# Altium schematic sheet Rx_TSOP.SchDoc: Balise IR-Rx - TSOP
size A3; Author: B Labbe; CompanyName: Oufffteam; DrawnBy: B Labbe; Engineer: B Labbe; Organization: Oufffteam; Address1: L3, 12a Rodborough Rd; Address2: Frenchs Forest; Address3: NSW; Address4: Australia 2086; Revision: B; SheetNumber: 5; SheetTotal: 5; DocumentName: Balise IR-Rx - TSOP
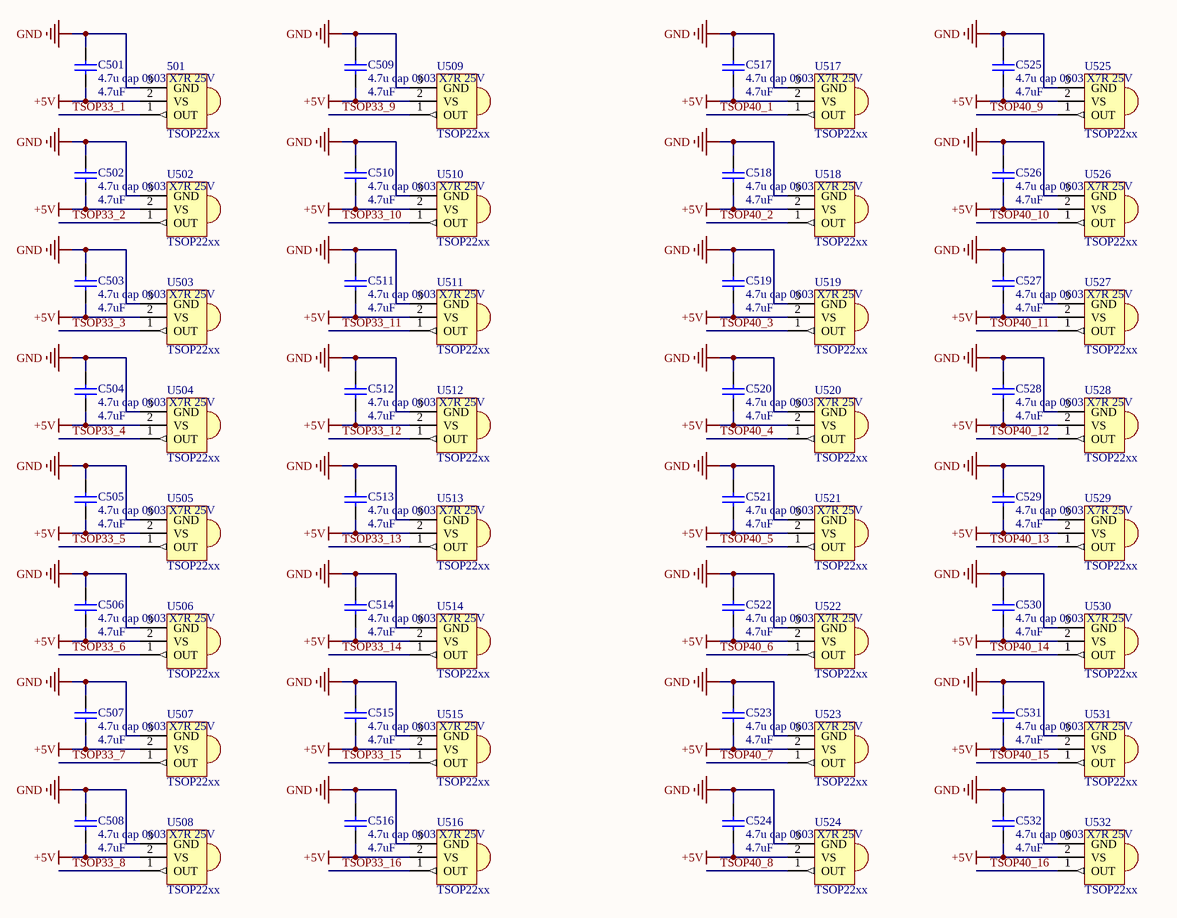
[diagram p0: Rx_TSOP.SchDoc]

## Parts
501  TSOP22xx  [TSOP22xx]
C501  4.7u cap 0603 X7R 25V  value 4.7uF  [0603]
C502  4.7u cap 0603 X7R 25V  value 4.7uF  [0603]
C503  4.7u cap 0603 X7R 25V  value 4.7uF  [0603]
C504  4.7u cap 0603 X7R 25V  value 4.7uF  [0603]
C505  4.7u cap 0603 X7R 25V  value 4.7uF  [0603]
C506  4.7u cap 0603 X7R 25V  value 4.7uF  [0603]
C507  4.7u cap 0603 X7R 25V  value 4.7uF  [0603]
C508  4.7u cap 0603 X7R 25V  value 4.7uF  [0603]
C509  4.7u cap 0603 X7R 25V  value 4.7uF  [0603]
C510  4.7u cap 0603 X7R 25V  value 4.7uF  [0603]
C511  4.7u cap 0603 X7R 25V  value 4.7uF  [0603]
C512  4.7u cap 0603 X7R 25V  value 4.7uF  [0603]
C513  4.7u cap 0603 X7R 25V  value 4.7uF  [0603]
C514  4.7u cap 0603 X7R 25V  value 4.7uF  [0603]
C515  4.7u cap 0603 X7R 25V  value 4.7uF  [0603]
C516  4.7u cap 0603 X7R 25V  value 4.7uF  [0603]
C517  4.7u cap 0603 X7R 25V  value 4.7uF  [0603]
C518  4.7u cap 0603 X7R 25V  value 4.7uF  [0603]
C519  4.7u cap 0603 X7R 25V  value 4.7uF  [0603]
C520  4.7u cap 0603 X7R 25V  value 4.7uF  [0603]
C521  4.7u cap 0603 X7R 25V  value 4.7uF  [0603]
C522  4.7u cap 0603 X7R 25V  value 4.7uF  [0603]
C523  4.7u cap 0603 X7R 25V  value 4.7uF  [0603]
C524  4.7u cap 0603 X7R 25V  value 4.7uF  [0603]
C525  4.7u cap 0603 X7R 25V  value 4.7uF  [0603]
C526  4.7u cap 0603 X7R 25V  value 4.7uF  [0603]
C527  4.7u cap 0603 X7R 25V  value 4.7uF  [0603]
C528  4.7u cap 0603 X7R 25V  value 4.7uF  [0603]
C529  4.7u cap 0603 X7R 25V  value 4.7uF  [0603]
C530  4.7u cap 0603 X7R 25V  value 4.7uF  [0603]
C531  4.7u cap 0603 X7R 25V  value 4.7uF  [0603]
C532  4.7u cap 0603 X7R 25V  value 4.7uF  [0603]
U502  TSOP22xx  [TSOP22xx]
U503  TSOP22xx  [TSOP22xx]
U504  TSOP22xx  [TSOP22xx]
U505  TSOP22xx  [TSOP22xx]
U506  TSOP22xx  [TSOP22xx]
U507  TSOP22xx  [TSOP22xx]
U508  TSOP22xx  [TSOP22xx]
U509  TSOP22xx  [TSOP22xx]
U510  TSOP22xx  [TSOP22xx]
U511  TSOP22xx  [TSOP22xx]
U512  TSOP22xx  [TSOP22xx]
U513  TSOP22xx  [TSOP22xx]
U514  TSOP22xx  [TSOP22xx]
U515  TSOP22xx  [TSOP22xx]
U516  TSOP22xx  [TSOP22xx]
U517  TSOP22xx  [TSOP22xx]
U518  TSOP22xx  [TSOP22xx]
U519  TSOP22xx  [TSOP22xx]
U520  TSOP22xx  [TSOP22xx]
U521  TSOP22xx  [TSOP22xx]
U522  TSOP22xx  [TSOP22xx]
U523  TSOP22xx  [TSOP22xx]
U524  TSOP22xx  [TSOP22xx]
U525  TSOP22xx  [TSOP22xx]
U526  TSOP22xx  [TSOP22xx]
U527  TSOP22xx  [TSOP22xx]
U528  TSOP22xx  [TSOP22xx]
U529  TSOP22xx  [TSOP22xx]
U530  TSOP22xx  [TSOP22xx]
U531  TSOP22xx  [TSOP22xx]
U532  TSOP22xx  [TSOP22xx]

## Nets
+5V: 501.2(VS) C501.1 C502.1 C503.1 C504.1 C505.1 C506.1 C507.1 C508.1 C509.1 C510.1 C511.1 C512.1 C513.1 C514.1 C515.1 C516.1 C517.1 C518.1 C519.1 C520.1 C521.1 C522.1 C523.1 C524.1 C525.1 C526.1 C527.1 C528.1 C529.1 C530.1 C531.1 C532.1 U502.2(VS) U503.2(VS) U504.2(VS) U505.2(VS) U506.2(VS) U507.2(VS) U508.2(VS) U509.2(VS) U510.2(VS) U511.2(VS) U512.2(VS) U513.2(VS) U514.2(VS) U515.2(VS) U516.2(VS) U517.2(VS) U518.2(VS) U519.2(VS) U520.2(VS) U521.2(VS) U522.2(VS) U523.2(VS) U524.2(VS) U525.2(VS) U526.2(VS) U527.2(VS) U528.2(VS) U529.2(VS) U530.2(VS) U531.2(VS) U532.2(VS)
GND: 501.3(GND) C501.2 C502.2 C503.2 C504.2 C505.2 C506.2 C507.2 C508.2 C509.2 C510.2 C511.2 C512.2 C513.2 C514.2 C515.2 C516.2 C517.2 C518.2 C519.2 C520.2 C521.2 C522.2 C523.2 C524.2 C525.2 C526.2 C527.2 C528.2 C529.2 C530.2 C531.2 C532.2 U502.3(GND) U503.3(GND) U504.3(GND) U505.3(GND) U506.3(GND) U507.3(GND) U508.3(GND) U509.3(GND) U510.3(GND) U511.3(GND) U512.3(GND) U513.3(GND) U514.3(GND) U515.3(GND) U516.3(GND) U517.3(GND) U518.3(GND) U519.3(GND) U520.3(GND) U521.3(GND) U522.3(GND) U523.3(GND) U524.3(GND) U525.3(GND) U526.3(GND) U527.3(GND) U528.3(GND) U529.3(GND) U530.3(GND) U531.3(GND) U532.3(GND)
TSOP33_1: 501.1(OUT)
TSOP33_2: U502.1(OUT)
TSOP33_3: U503.1(OUT)
TSOP33_4: U504.1(OUT)
TSOP33_5: U505.1(OUT)
TSOP33_6: U506.1(OUT)
TSOP33_7: U507.1(OUT)
TSOP33_8: U508.1(OUT)
TSOP33_9: U509.1(OUT)
TSOP33_10: U510.1(OUT)
TSOP33_11: U511.1(OUT)
TSOP33_12: U512.1(OUT)
TSOP33_13: U513.1(OUT)
TSOP33_14: U514.1(OUT)
TSOP33_15: U515.1(OUT)
TSOP33_16: U516.1(OUT)
TSOP40_1: U517.1(OUT)
TSOP40_2: U518.1(OUT)
TSOP40_3: U519.1(OUT)
TSOP40_4: U520.1(OUT)
TSOP40_5: U521.1(OUT)
TSOP40_6: U522.1(OUT)
TSOP40_7: U523.1(OUT)
TSOP40_8: U524.1(OUT)
TSOP40_9: U525.1(OUT)
TSOP40_10: U526.1(OUT)
TSOP40_11: U527.1(OUT)
TSOP40_12: U528.1(OUT)
TSOP40_13: U529.1(OUT)
TSOP40_14: U530.1(OUT)
TSOP40_15: U531.1(OUT)
TSOP40_16: U532.1(OUT)

## Notes on the sheet
- Title
- Size:
- Date:
- A3
- Number:
- Time:
- Revision:
- Sheet
- of
- Oufffteam
- 3 place Carnot
- 26100
- Romans sur Isère
- oufffteam@gmail.com
- File:

## Library data of the parts
501 U502-U532 = TSOP22xx: IR Receiver Modules for Remote Control Systems
C501-C532 = Cap: Capacitor; Published: 8-Jun-2000; LatestRevisionDate: 17-Jul-2002; LatestRevisionNote: Re-released for DXP Platform.; PackageReference: RAD-0.3; Publisher: Altium Limited